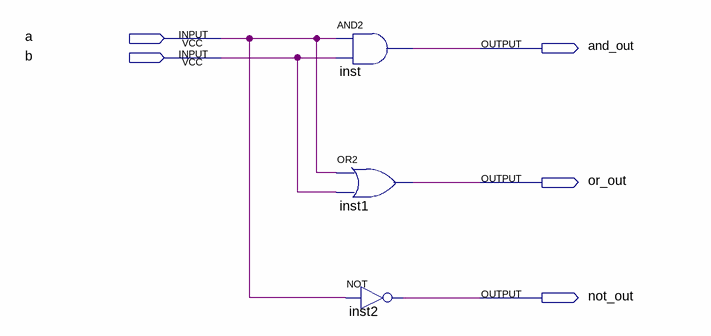
[diagram p0: schematic sheet]
// Quartus schematic AndOr.bdf as structural Verilog: 3 symbols, 5 pins
module AndOr (
  input  a,
  input  b,
  output and_out,
  output or_out,
  output not_out
);

  and inst (and_out, a, b);
  or inst1 (or_out, a, b);
  not inst2 (not_out, a);
endmodule
